# EAGLE schematic v0.1 (EAGLE 9.2.2)
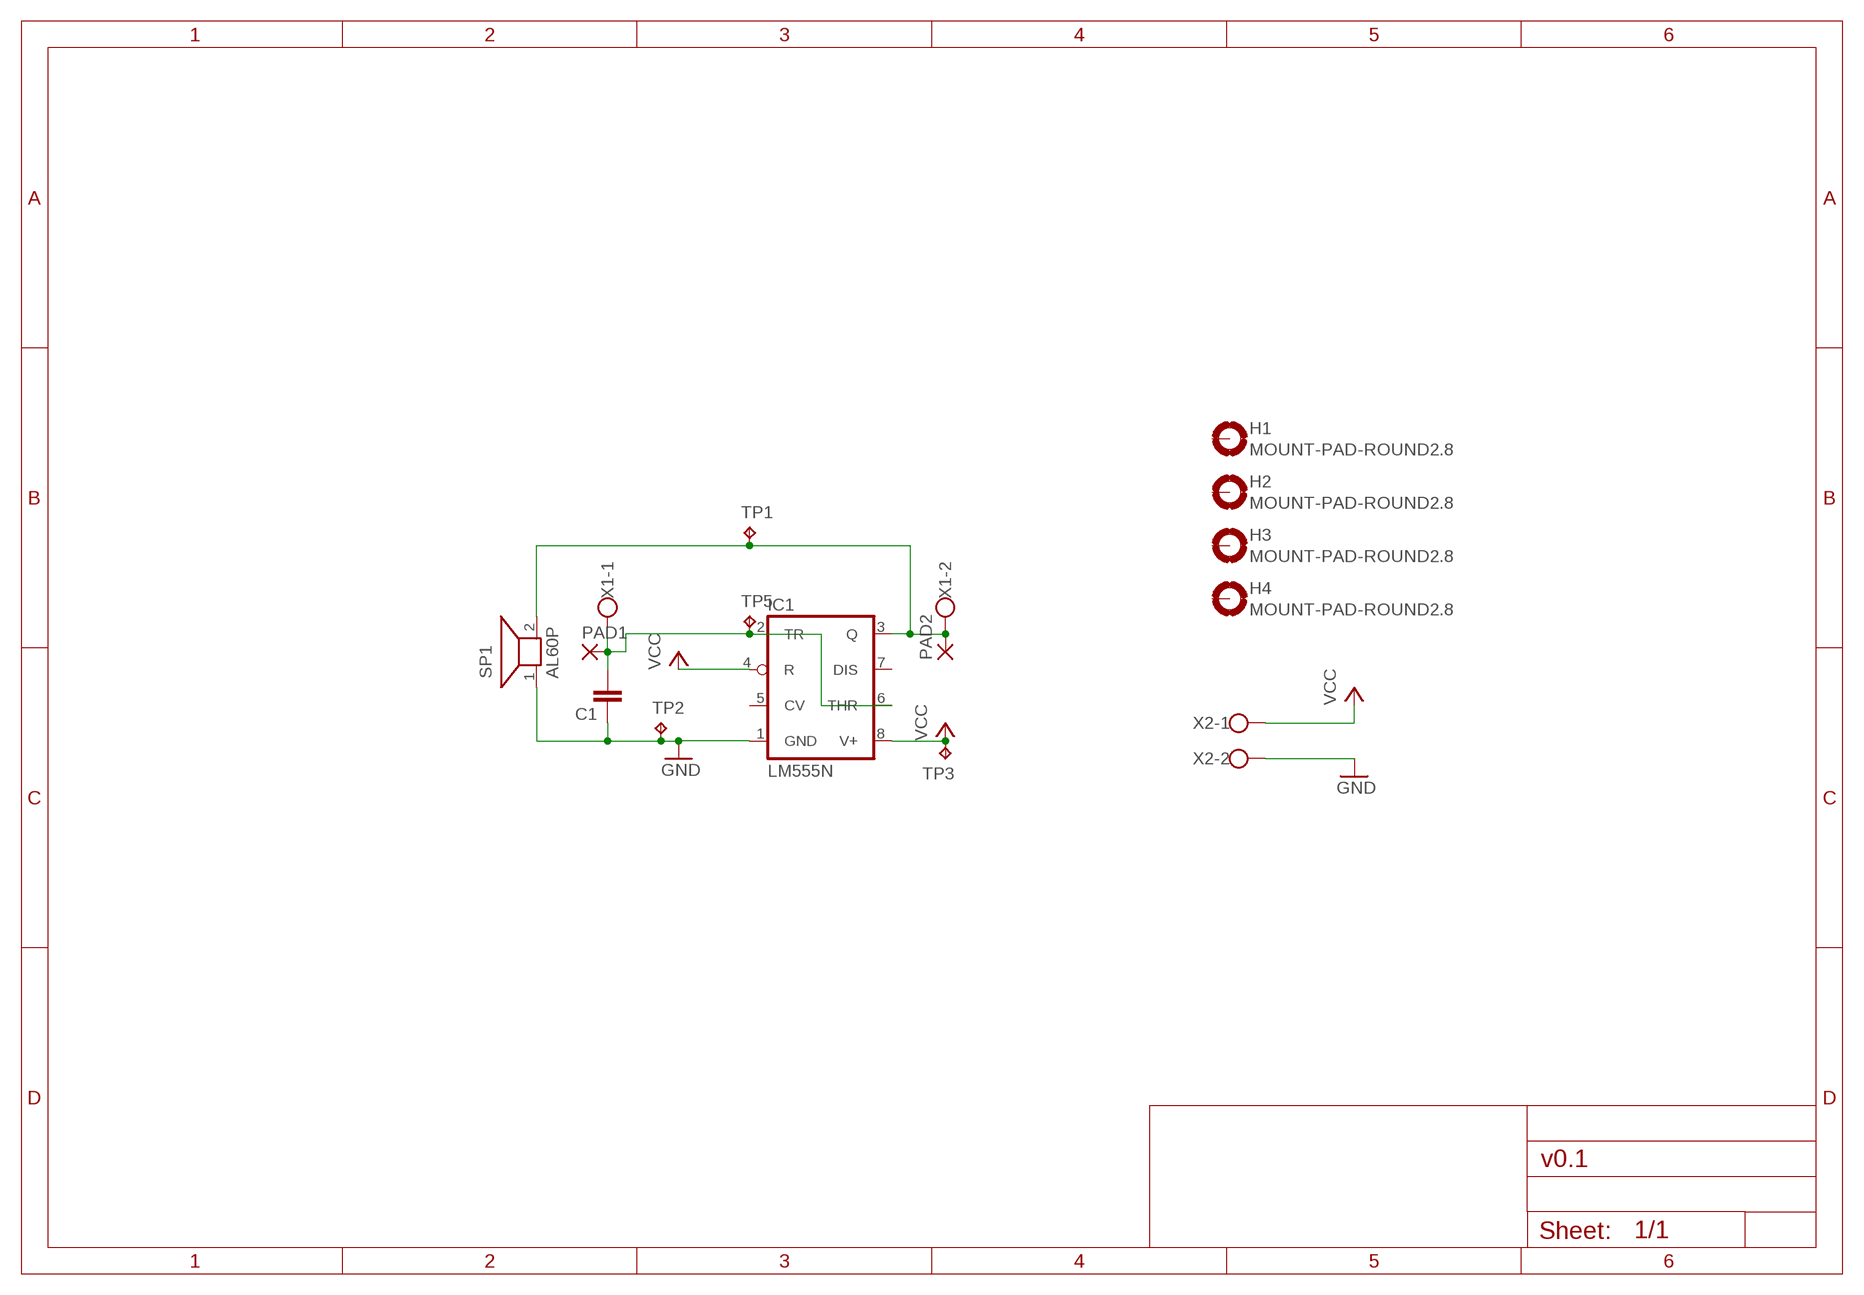
[diagram p0: schematic, sheet 1]

## Parts
C1  C2,5-3  [C2.5-3]
H1  MOUNT-PAD-ROUND2.8  [2,8-PAD]
H2  MOUNT-PAD-ROUND2.8  [2,8-PAD]
H3  MOUNT-PAD-ROUND2.8  [2,8-PAD]
H4  MOUNT-PAD-ROUND2.8  [2,8-PAD]
IC1  LM555N  [DIL08]
PAD1  SMD5  [SMD2,54-5,08]
PAD2  SMD5  [SMD2,54-5,08]
SP1  AL60P  [AL60P]
TP1  TPB1,27  [B1,27]
TP2  TPB1,27  [B1,27]
TP3  TPB1,27  [B1,27]
TP5  TPB1,27  [B1,27]
X1  W237-102  [W237-102]
X2  W237-102  [W237-102]

## Nets
GND: C1.1 IC1.1(GND) SP1.1 TP2.TP X2.2
N$1: C1.2 IC1.2(TR) IC1.6(THR) PAD1.1(P) TP5.TP X1.1
N$2: IC1.3(Q) PAD2.1(P) SP1.2 TP1.TP X1.2
VCC: IC1.4(R) IC1.8(V+) TP3.TP X2.1
Unconnected: H1.B2,8(MOUNT) H2.B2,8(MOUNT) H3.B2,8(MOUNT) H4.B2,8(MOUNT) IC1.5(CV) IC1.7(DIS)

## Library data of the parts
C1 = capacitor-wima:C: CAPACITOR naming: grid - package width
H1-H4 = holes:MOUNT-PAD-ROUND: MOUNTING PAD, round
IC1 = linear:*555: TIMER
PAD1 PAD2 = wirepad:SMD5: SMD PAD
SP1 = buzzer:AL60P: SPEAKER Source: Buerklin; OC_FARNELL: unknown; OC_NEWARK: unknown
TP1-TP3 TP5 = testpad:TP: Test pad
X1 X2 = con-wago-500:W237-102: WAGO SCREW CLAMP; MPN: 237-102; OC_FARNELL: unknown; OC_NEWARK: 70K9898